# Altium schematic sheet LPC1768_1.SchDoc: LPC1768
size 298 x 212 mm; Date: 31.05.2016 15:06:25; SheetNumber: 2
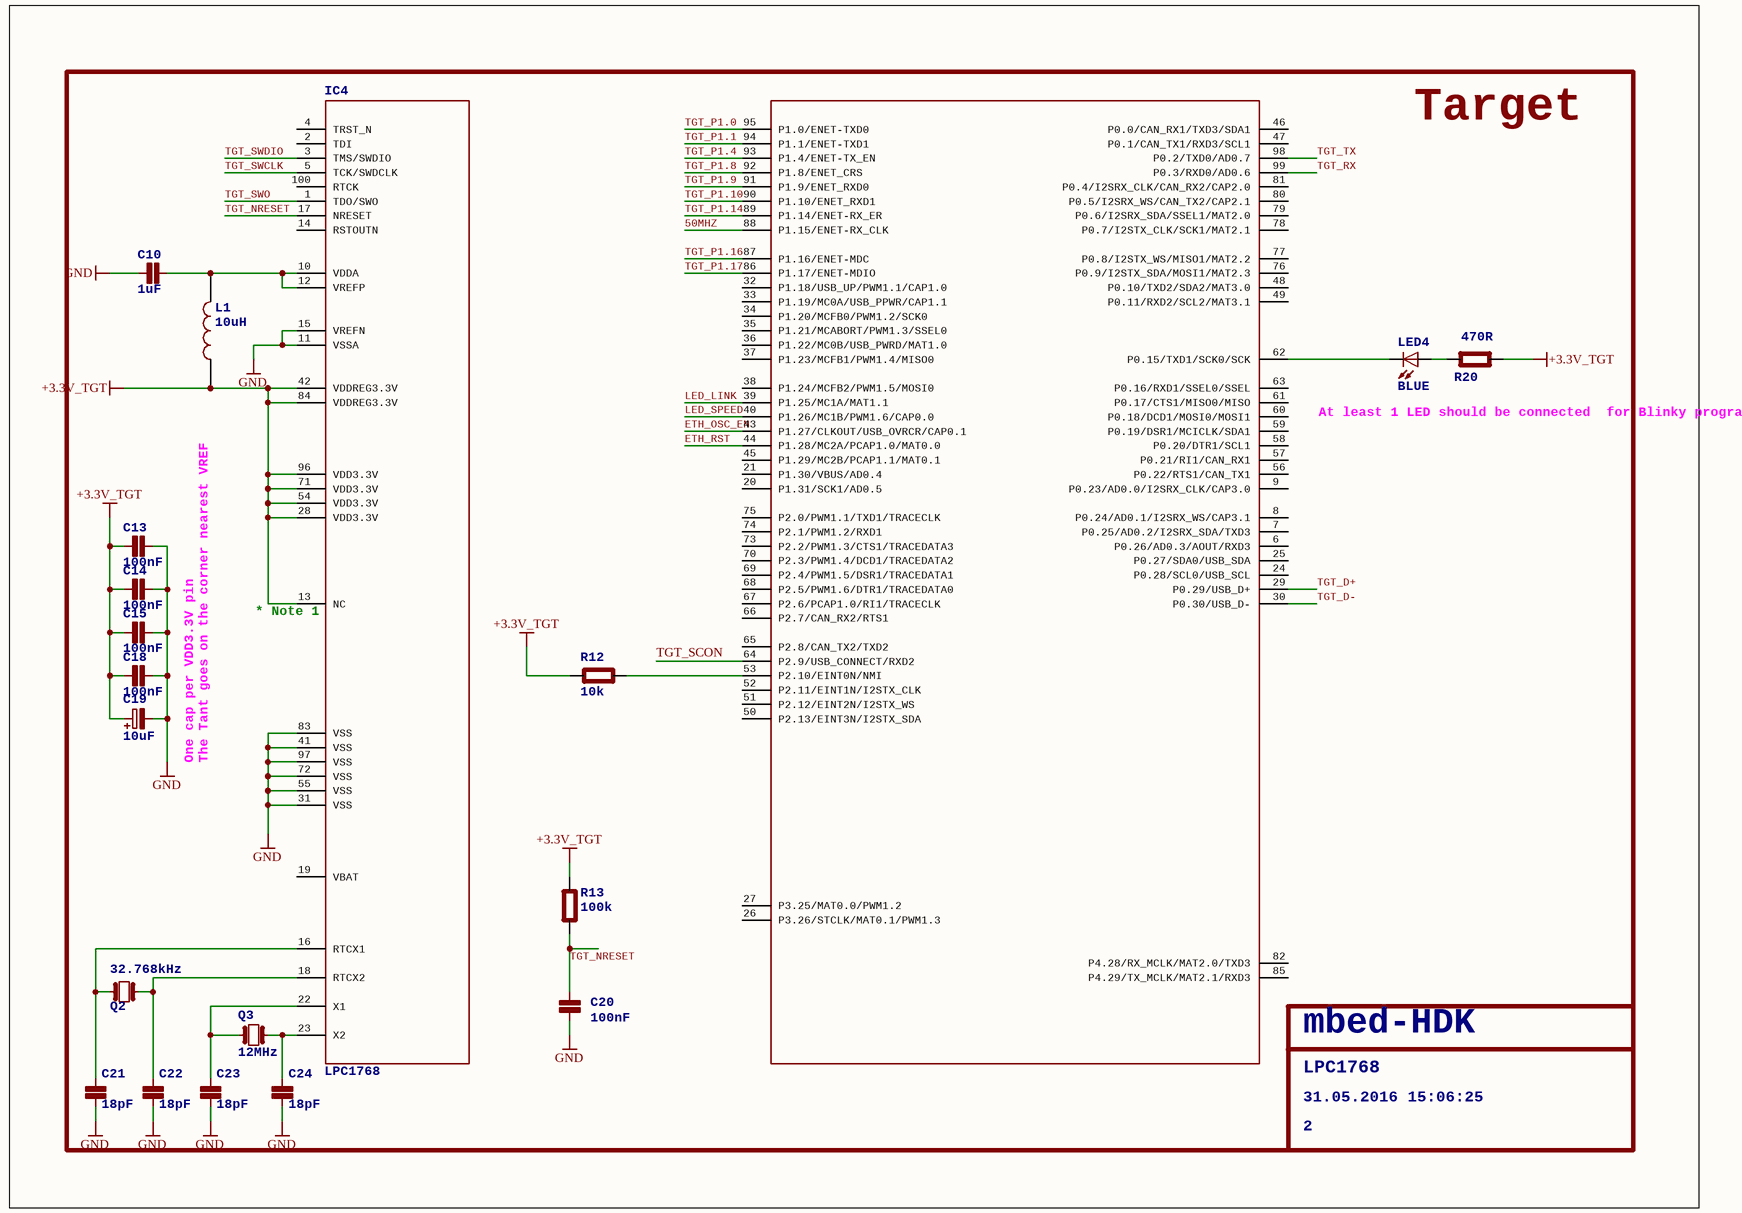
[diagram p0: LPC1768_1.SchDoc]

## Parts
C10  1uF  [0603]
C13  100nF  [0603]
C14  100nF  [0603]
C15  100nF  [0603]
C18  100nF  [0603]
C19  10uF  [CASE-B]
C20  100nF  [0603]
C21  18pF  [0603]
C22  18pF  [0603]
C23  18pF  [0603]
C24  18pF  [0603]
IC4  LPC1768  [LQFP100]
L1  10uH  [0603]
LED4  BLUE  [CHIPLED_0603]
Q2  32.768kHz  [FC135]
Q3  12MHz  [HC49UP]
R12  10k  [0603]
R13  100k  [0603]
R20  470R  [0603]

## Nets
+3.3V_TGT: C13.1(P$1) C14.1(P$1) C15.1(P$1) C18.1(P$1) C19.1 IC4.13(NC) IC4.28(VDD3.3V) IC4.42(VDDREG3.3V) IC4.54(VDD3.3V) IC4.71(VDD3.3V) IC4.84(VDDREG3.3V) IC4.96(VDD3.3V) L1.1(P$1) R12.1(P$1) R13.2(P$2) R20.1(P$1)
GND: C10.2(P$2) C13.2(P$2) C14.2(P$2) C15.2(P$2) C18.2(P$2) C19.2 C20.1(P$1) C21.1(P$1) C22.1(P$1) C23.1(P$1) C24.1(P$1) IC4.11(VSSA) IC4.15(VREFN) IC4.31(VSS) IC4.41(VSS) IC4.55(VSS) IC4.72(VSS) IC4.83(VSS) IC4.97(VSS)
50MHZ: IC4.88(P1.15/ENET-RX_CLK)
ETH_OSC_EN: IC4.43(P1.27/CLKOUT/USB_OVRCR/CAP0.1)
ETH_RST: IC4.44(P1.28/MC2A/PCAP1.0/MAT0.0)
LED_LINK: IC4.39(P1.25/MC1A/MAT1.1)
LED_SPEED: IC4.40(P1.26/MC1B/PWM1.6/CAP0.0)
TGT_D+: IC4.29(P0.29/USB_D+)
TGT_D-: IC4.30(P0.30/USB_D-)
TGT_NRESET: C20.2(P$2) IC4.17(NRESET) R13.1(P$1)
TGT_P1.0: IC4.95(P1.0/ENET-TXD0)
TGT_P1.1: IC4.94(P1.1/ENET-TXD1)
TGT_P1.4: IC4.93(P1.4/ENET-TX_EN)
TGT_P1.8: IC4.92(P1.8/ENET_CRS)
TGT_P1.9: IC4.91(P1.9/ENET_RXD0)
TGT_P1.10: IC4.90(P1.10/ENET_RXD1)
TGT_P1.14: IC4.89(P1.14/ENET-RX_ER)
TGT_P1.16: IC4.87(P1.16/ENET-MDC)
TGT_P1.17: IC4.86(P1.17/ENET-MDIO)
TGT_RX: IC4.99(P0.3/RXD0/AD0.6)
TGT_SCON: IC4.64(P2.9/USB_CONNECT/RXD2)
TGT_SWCLK: IC4.5(TCK/SWDCLK)
TGT_SWDIO: IC4.3(TMS/SWDIO)
TGT_SWO: IC4.1(TDO/SWO)
TGT_TX: IC4.98(P0.2/TXD0/AD0.7)
NetC10_1: C10.1(P$1) IC4.10(VDDA) IC4.12(VREFP) L1.2(P$2)
NetC21_2: C21.2(P$2) IC4.16(RTCX1) Q2.X2
NetC22_2: C22.2(P$2) IC4.18(RTCX2) Q2.X1
NetC23_2: C23.2(P$2) IC4.22(X1) Q3.1
NetC24_2: C24.2(P$2) IC4.23(X2) Q3.2
NetIC4_53: IC4.53(P2.10/EINT0N/NMI) R12.2(P$2)
NetIC4_62: IC4.62(P0.15/TXD1/SCK0/SCK) LED4.C
NetLED4_A: LED4.A R20.2(P$2)

Not connected (* = marked no-connect by the designer): IC4 2(TDI) 4(TRST_N) 6(P0.26/AD0.3/AOUT/RXD3) 7(P0.25/AD0.2/I2SRX_SDA/TXD3) 8(P0.24/AD0.1/I2SRX_WS/CAP3.1) 9(P0.23/AD0.0/I2SRX_CLK/CAP3.0) 14(RSTOUTN) 19(VBAT) 20(P1.31/SCK1/AD0.5) 21(P1.30/VBUS/AD0.4) 24(P0.28/SCL0/USB_SCL) 25(P0.27/SDA0/USB_SDA) 26(P3.26/STCLK/MAT0.1/PWM1.3) 27(P3.25/MAT0.0/PWM1.2) 32(P1.18/USB_UP/PWM1.1/CAP1.0) 33(P1.19/MC0A/USB_PPWR/CAP1.1) 34(P1.20/MCFB0/PWM1.2/SCK0) 35(P1.21/MCABORT/PWM1.3/SSEL0) 36(P1.22/MC0B/USB_PWRD/MAT1.0) 37(P1.23/MCFB1/PWM1.4/MISO0) 38(P1.24/MCFB2/PWM1.5/MOSI0) 45(P1.29/MC2B/PCAP1.1/MAT0.1) 46(P0.0/CAN_RX1/TXD3/SDA1) 47(P0.1/CAN_TX1/RXD3/SCL1) 48(P0.10/TXD2/SDA2/MAT3.0) 49(P0.11/RXD2/SCL2/MAT3.1) 50(P2.13/EINT3N/I2STX_SDA) 51(P2.12/EINT2N/I2STX_WS) 52(P2.11/EINT1N/I2STX_CLK) 56(P0.22/RTS1/CAN_TX1) 57(P0.21/RI1/CAN_RX1) 58(P0.20/DTR1/SCL1) 59(P0.19/DSR1/MCICLK/SDA1) 60(P0.18/DCD1/MOSI0/MOSI1) 61(P0.17/CTS1/MISO0/MISO) 63(P0.16/RXD1/SSEL0/SSEL) 65(P2.8/CAN_TX2/TXD2) 66(P2.7/CAN_RX2/RTS1) 67(P2.6/PCAP1.0/RI1/TRACECLK) 68(P2.5/PWM1.6/DTR1/TRACEDATA0) 69(P2.4/PWM1.5/DSR1/TRACEDATA1) 70(P2.3/PWM1.4/DCD1/TRACEDATA2) 73(P2.2/PWM1.3/CTS1/TRACEDATA3) 74(P2.1/PWM1.2/RXD1) 75(P2.0/PWM1.1/TXD1/TRACECLK) 76(P0.9/I2STX_SDA/MOSI1/MAT2.3) 77(P0.8/I2STX_WS/MISO1/MAT2.2) 78(P0.7/I2STX_CLK/SCK1/MAT2.1) 79(P0.6/I2SRX_SDA/SSEL1/MAT2.0) 80(P0.5/I2SRX_WS/CAN_TX2/CAP2.1) 81(P0.4/I2SRX_CLK/CAN_RX2/CAP2.0) 82(P4.28/RX_MCLK/MAT2.0/TXD3) 85(P4.29/TX_MCLK/MAT2.1/RXD3) 100(RTCK)

## Notes on the sheet
- Target
- At least 1 LED should be connected
  for Blinky programs
- (near IC4) * Note 1
- One cap per VDD3.3V pin
- The Tant goes on the corner nearest VREF
- (near IC4) LPC1768
- (near IC4) mbed-HDK
- 31.05.2016 15:06:25
- 2

## Library data of the parts
C10 C13-C15 C18 C20-C24 = C0603
C19 = C-POLB
L1 = L
LED4 = LED0603
Q2 = Q_FC135
Q3 = Q_HC49UP
R12 R13 R20 = R0603